# EAGLE schematic roverPCB_simple (EAGLE 9.2.2)
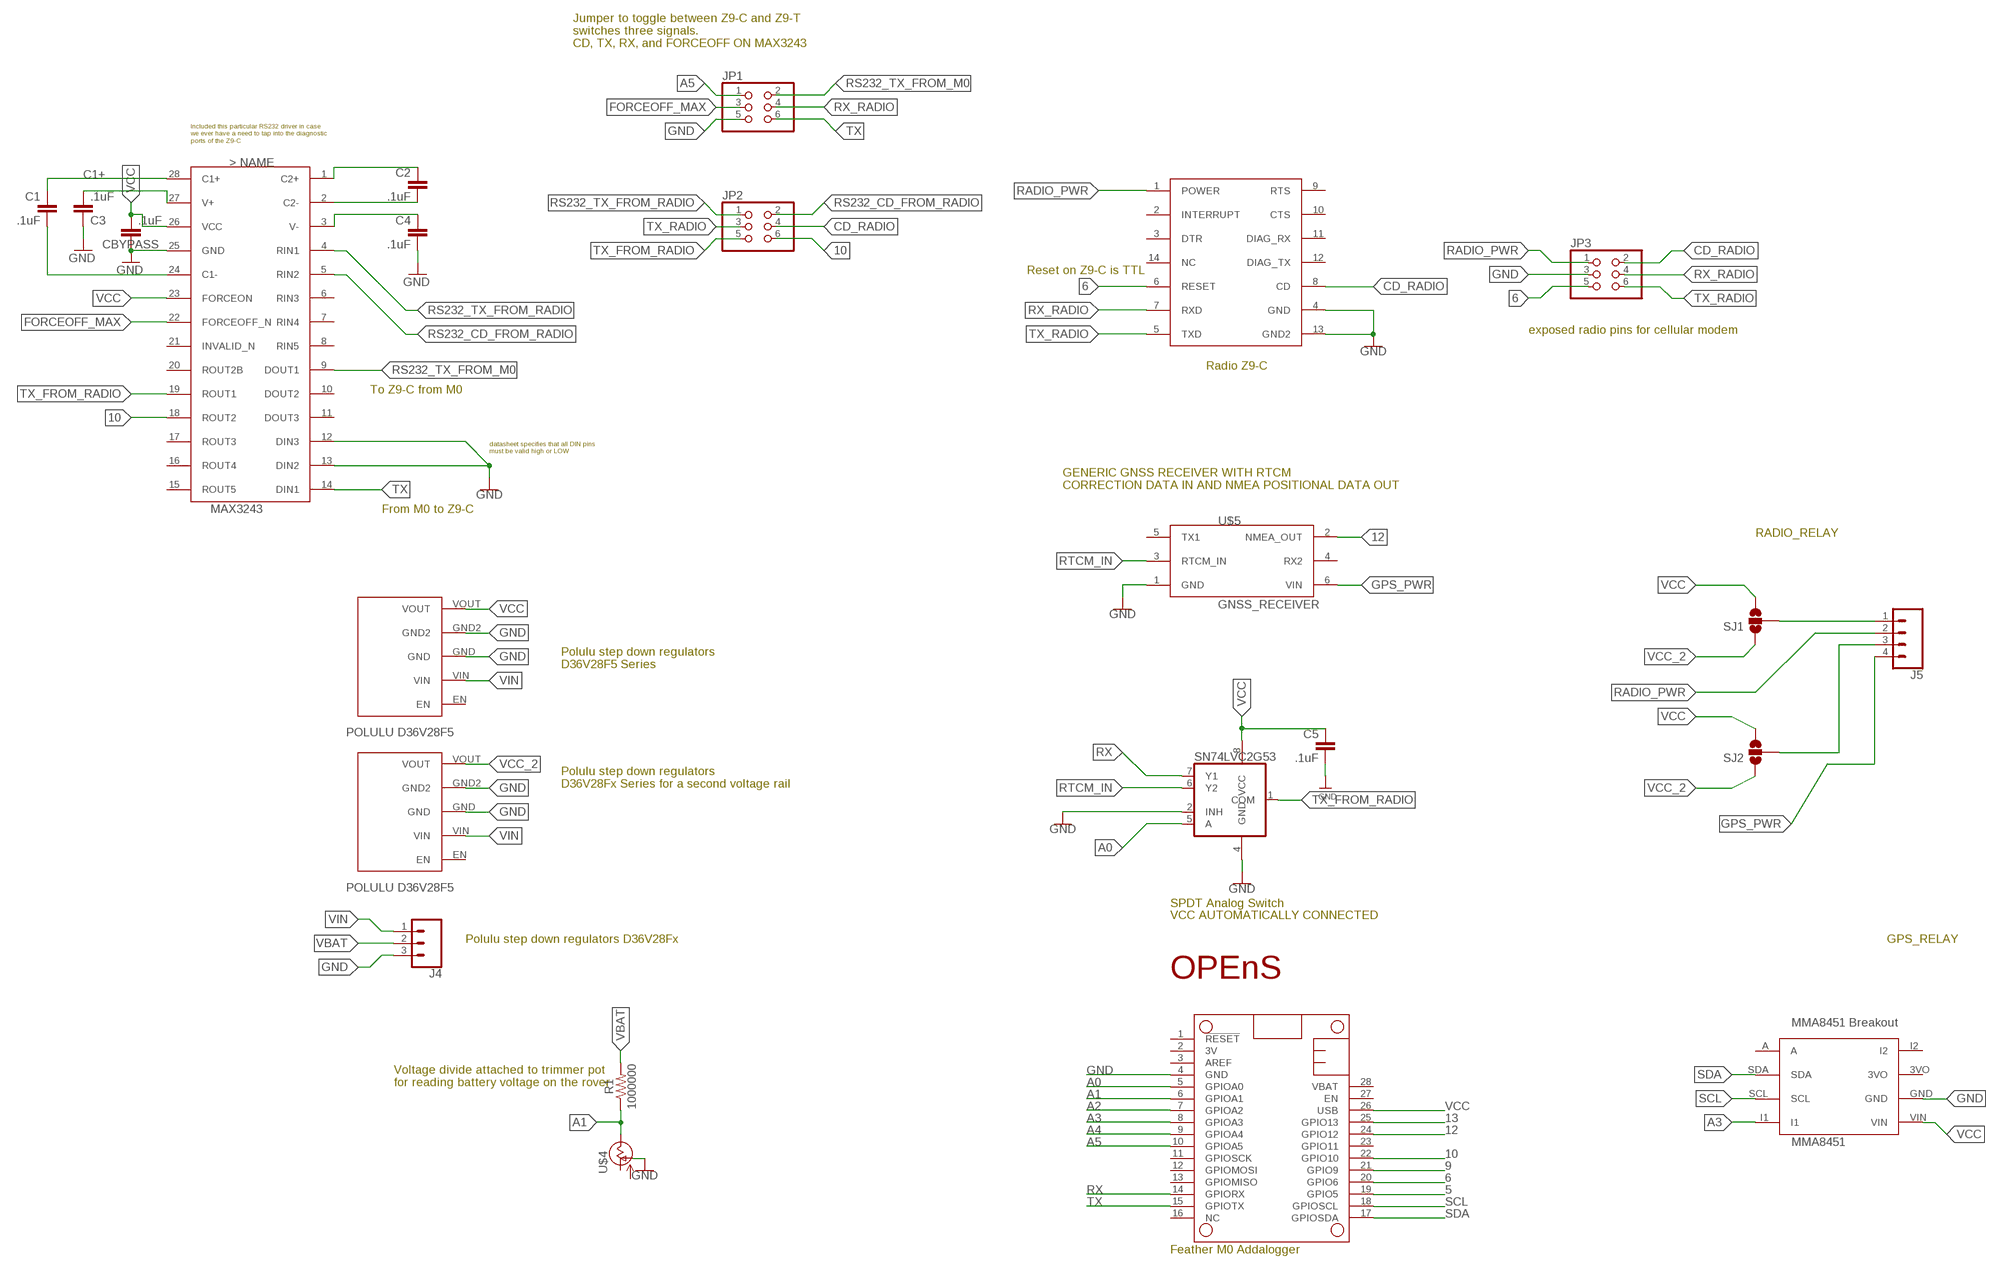
[diagram p0: schematic, sheet 1]

## Parts
C1  .1uF  CC1206  [C1206]
C2  .1uF  CC1206  [C1206]
C3  .1uF  CC1206  [C1206]
C4  .1uF  CC1206  [C1206]
C5  .1uF  CC1206  [C1206]
CBYPASS  .1uF  CC1206  [C1206]
J4  CONN_03SCREW  [SCREWTERMINAL-3.5MM-3]
J5  CONN_04SCREW  [SCREWTERMINAL-3.5MM-4]
JP1  PINHD-2X3  [2X03]
JP2  PINHD-2X3  [2X03]
JP3  PINHD-2X3  [2X03]
MS1  FEATHERWING  [FEATHERWING]
R1  1000000  1.6KOHM-0603-1/10W-1%  [0603]
SJ1  SOLDERJUMPER_2WAY-OLDT  [SJ_2]
SJ2  SOLDERJUMPER_2WAY-OLDT  [SJ_2]
SN74LVC2G53  741G53DCT  [DCT_R-PDSO-G8]
U$1  MAX3243  [SSOP-28]
U$2  OPENS-LOGO  [OPENS-LOGO]
U$3  Z9-T/Z9-C  [Z9-T/Z9-C]
U$4  CT6EP205  [CT6]
U$5  GNSS_RECEIVER  [MA03-2]
U$7  POLULU_D36V28FX  [POLULU_D36V28FX]
U$8  POLULU_D36V28FX  [POLULU_D36V28FX]
U$9  MMA8451  [MMA8451]

## Nets
5: MS1.19(GPIO5)
6: JP3.5 MS1.20(GPIO6) U$3.6(RESET)
9: MS1.21(GPIO9)
10: JP2.6 MS1.22(GPIO10) U$1.18(ROUT2)
12: MS1.24(GPIO12) U$5.2(NMEA_OUT)
13: MS1.25(GPIO13)
A0: MS1.5(GPIOA0) SN74LVC2G53.5(A)
A1: MS1.6(GPIOA1) R1.1 U$4.S(VSS)
A2: MS1.7(GPIOA2)
A3: MS1.8(GPIOA3) U$9.I1
A4: MS1.9(GPIOA4)
A5: JP1.1 MS1.10(GPIOA5)
C1+: C1.1 U$1.28(C1+)
CD_RADIO: JP2.4 JP3.2 U$3.8(CD)
FORCEOFF_MAX: JP1.3 U$1.22(FORCEOFF_N)
GND: C3.1 C4.2 C5.2 CBYPASS.1 J4.3 JP1.5 JP3.3 MS1.4(GND) SN74LVC2G53.2(INH) SN74LVC2G53.4(GND) U$1.12(DIN3) U$1.13(DIN2) U$1.25(GND) U$3.4(GND) U$3.13(GND2) U$4.A(OUT) U$5.1(GND) U$7.GND U$7.GND2 U$8.GND U$8.GND2 U$9.GND
GPS_PWR: J5.4 U$5.6(VIN)
N$4: C2.1 U$1.1(C2+)
N$5: C2.2 U$1.2(C2-)
N$9: J5.1 SJ1.2
N$10: C4.1 U$1.3(V-)
N$11: C1.2 U$1.24(C1-)
N$12: J5.3 SJ2.2
N$13: C3.2 U$1.27(V+)
RADIO_PWR [Power]: J5.2 JP3.1 U$3.1(POWER)
RS232_CD_FROM_RADIO: JP2.2 U$1.5(RIN2)
RS232_TX_FROM_M0: JP1.2 U$1.9(DOUT1)
RS232_TX_FROM_RADIO: JP2.1 U$1.4(RIN1)
RTCM_IN: SN74LVC2G53.6(Y2) U$5.3(RTCM_IN)
RX: MS1.14(GPIORX) SN74LVC2G53.7(Y1)
RX_RADIO: JP1.4 JP3.4 U$3.7(RXD)
SCL: MS1.18(GPIOSCL) U$9.SCL
SDA: MS1.17(GPIOSDA) U$9.SDA
TX: JP1.6 MS1.15(GPIOTX) U$1.14(DIN1)
TX_FROM_RADIO: JP2.5 SN74LVC2G53.1(COM) U$1.19(ROUT1)
TX_RADIO: JP2.3 JP3.6 U$3.5(TXD)
VBAT: J4.2 R1.2
VCC: C5.1 CBYPASS.2 MS1.26(USB) SJ1.3 SJ2.3 SN74LVC2G53.8(VCC) U$1.23(FORCEON) U$1.26(VCC) U$7.VOUT U$9.VIN
VCC_2: SJ1.1 SJ2.1 U$8.VOUT
VIN: J4.1 U$7.VIN U$8.VIN
Unconnected: MS1.1(!RESET) MS1.2(3V) MS1.3(AREF) MS1.11(GPIOSCK) MS1.12(GPIOMOSI) MS1.13(GPIOMISO) MS1.16(NC) MS1.23(GPIO11) MS1.27(EN) MS1.28(VBAT) U$1.6(RIN3) U$1.7(RIN4) U$1.8(RIN5) U$1.10(DOUT2) U$1.11(DOUT3) U$1.15(ROUT5) U$1.16(ROUT4) U$1.17(ROUT3) U$1.20(ROUT2B) U$1.21(INVALID_N) U$3.2(INTERRUPT) U$3.3(DTR) U$3.9(RTS) U$3.10(CTS) U$3.11(DIAG_RX) U$3.12(DIAG_TX) U$3.14(NC) U$4.E(VDD) U$5.4(RX2) U$5.5(TX1) U$7.EN U$8.EN U$9.3VO U$9.A U$9.I2

## Notes on the sheet
- Jumper to toggle between Z9-C and Z9-T
  switches three signals. 
  CD, TX, RX, and FORCEOFF ON MAX3243
- Included this particular RS232 driver in case
  we ever have a need to tap into the diagnostic
  ports of the Z9-C
- Reset on Z9-C is TTL
- exposed radio pins for cellular modem
- Radio Z9-C
- To Z9-C from M0
- datasheet specifies that all DIN pins 
  must be valid high or LOW
- GENERIC GNSS RECEIVER WITH RTCM
  CORRECTION DATA IN AND NMEA POSITIONAL DATA OUT
- From M0 to Z9-C
- RADIO_RELAY
- Polulu step down regulators 
  D36V28F5 Series
- Polulu step down regulators 
  D36V28Fx Series for a second voltage rail
- SPDT Analog Switch
- VCC AUTOMATICALLY CONNECTED
- Polulu step down regulators D36V28Fx | GPS_RELAY
- Voltage divide attached to trimmer pot 
  for reading battery voltage on the rover
- Feather M0 Addalogger

## Library data of the parts
C1-C5 CBYPASS = eagle-ltspice:C: CAPACITOR, European symbol; SPICEMODEL: NONE; SPICEPREFIX: C
J4 = SparkFun-Connectors:CONN_03: Multi connection point. Often used as Generic Header-pin footprint for 0.1 inch spaced/style header connections On any of the 0.1 inch spaced packages, you can populate with these: Break Away Headers - Straight <https://www.sparkfun.com/products/116> (PRT-00116) Break Away Male Headers - Right Angle <https://www.sparkfun.com/products/553> (PRT-00553) Female Headers <https://www.sparkfun.com/products/115> (PRT-00115) Break Away Headers - Machine Pin <https://www.sparkfun.com/products/117> (PRT-00117) Break Away Female Headers - Swiss Machine Pin <https://www.sparkfun.com/products/743> (PRT-00743) Stackable Header - 3 Pin (Female, 0.1") <https://www.sparkfun.com/products/13875> (PRT-13875) For SCREWTERMINALS and SPRING TERMINALS visit here: Screw Terimnals on SparkFun.com <https://www.sparkfun.com/search/results?term=Screw+Terminals> (5mm/3.5mm/2.54mm spacing) This device is also useful as a general connection point to wire up your design to another part of your project. Our various solder wires solder well into these plated through hole pads. Hook-Up Wire - Assortment (Stranded, 22 AWG) <https://www.sparkfun.com/products/11375> (PRT-11375) Hook-Up Wire - Assortment (Solid Core, 22 AWG) <https://www.sparkfun.com/products/11367> (PRT-11367) View the entire wire category on our website here <https://www.sparkfun.com/categories/141> Special notes: Molex polarized connector foot print use with SKU : PRT-08232 with associated crimp pins and housings.; PROD_ID: CONN-08288; SF_ID: PRT-08235
J5 = SparkFun-Connectors:CONN_04: Multi connection point. Often used as Generic Header-pin footprint for 0.1 inch spaced/style header connections On any of the 0.1 inch spaced packages, you can populate with these: Break Away Headers - Straight <https://www.sparkfun.com/products/116> (PRT-00116) Break Away Male Headers - Right Angle <https://www.sparkfun.com/products/553> (PRT-00553) Female Headers <https://www.sparkfun.com/products/115> (PRT-00115) Break Away Headers - Machine Pin <https://www.sparkfun.com/products/117> (PRT-00117) Break Away Female Headers - Swiss Machine Pin <https://www.sparkfun.com/products/743> (PRT-00743) For SCREWTERMINALS and SPRING TERMINALS visit here: Screw Terimnals on SparkFun.com <https://www.sparkfun.com/search/results?term=Screw+Terminals> (5mm/3.5mm/2.54mm spacing) This device is also useful as a general connection point to wire up your design to another part of your project. Our various solder wires solder well into these plated through hole pads. Hook-Up Wire - Assortment (Stranded, 22 AWG) <https://www.sparkfun.com/products/11375> (PRT-11375) Hook-Up Wire - Assortment (Solid Core, 22 AWG) <https://www.sparkfun.com/products/11367> (PRT-11367) View the entire wire category on our website here <https://www.sparkfun.com/categories/141> Special notes: Molex polarized connector foot print use with SKU : PRT-08231 with associated crimp pins and housings. 1MM SMD Version SKU: PRT-10208; PROD_ID: 2xCONN-08399; SF_ID: 2xPRT-08084
JP1-JP3 = pinhead:PINHD-2X3: PIN HEADER
MS1 = adafruit:FEATHERWING
R1 = SparkFun-Resistors:1.6KOHM: 1.6kΩ resistor A resistor is a passive two-terminal electrical component that implements electrical resistance as a circuit element. Resistors act to reduce current flow, and, at the same time, act to lower voltage levels within circuits. - Wikipedia; PROD_ID: RES-08361; VALUE: 1.6k
SJ1 SJ2 = SparkFun-Retired:SOLDERJUMPER_2WAY-OLD: Solder Jumper 2 way solder jumper
SN74LVC2G53 = 74xx-little-de:74*1G53: SINGLE-POLE DOUBLE-THROW (SPDT) ANALOG SWITCH 2:1 ANALOG MULTIPLEXER/DEMULTIPLEXER Source: http://focus.ti.com/lit/ds/symlink/sn74lvc2g53.pdf
U$1 = ftdi4:MAX3243: MAX3243 RS232 interface 5 receive lines 3 line drives 5V or 3.3V operating voltage
U$2 = opens-logo:OPENS-LOGO: OPENS Lab Logo
U$3 = SlideSentinel:Z9-T/Z9-C
U$4 = tango:CT6EP205
U$5 = SlideSentinel:GNSS_RECEIVER
U$7 U$8 = SlideSentinel:POLULU_D36V28FX
U$9 = SlideSentinel:MMA8451

## Net classes
0 default: width 0.305 mm, drill 0.508 mm, clearance 0.254 mm
1 Power: width 0.635 mm, drill 1.27 mm, clearance 0.508 mm